# Altium project Medusa-AI-coral-dev.PrjPcb
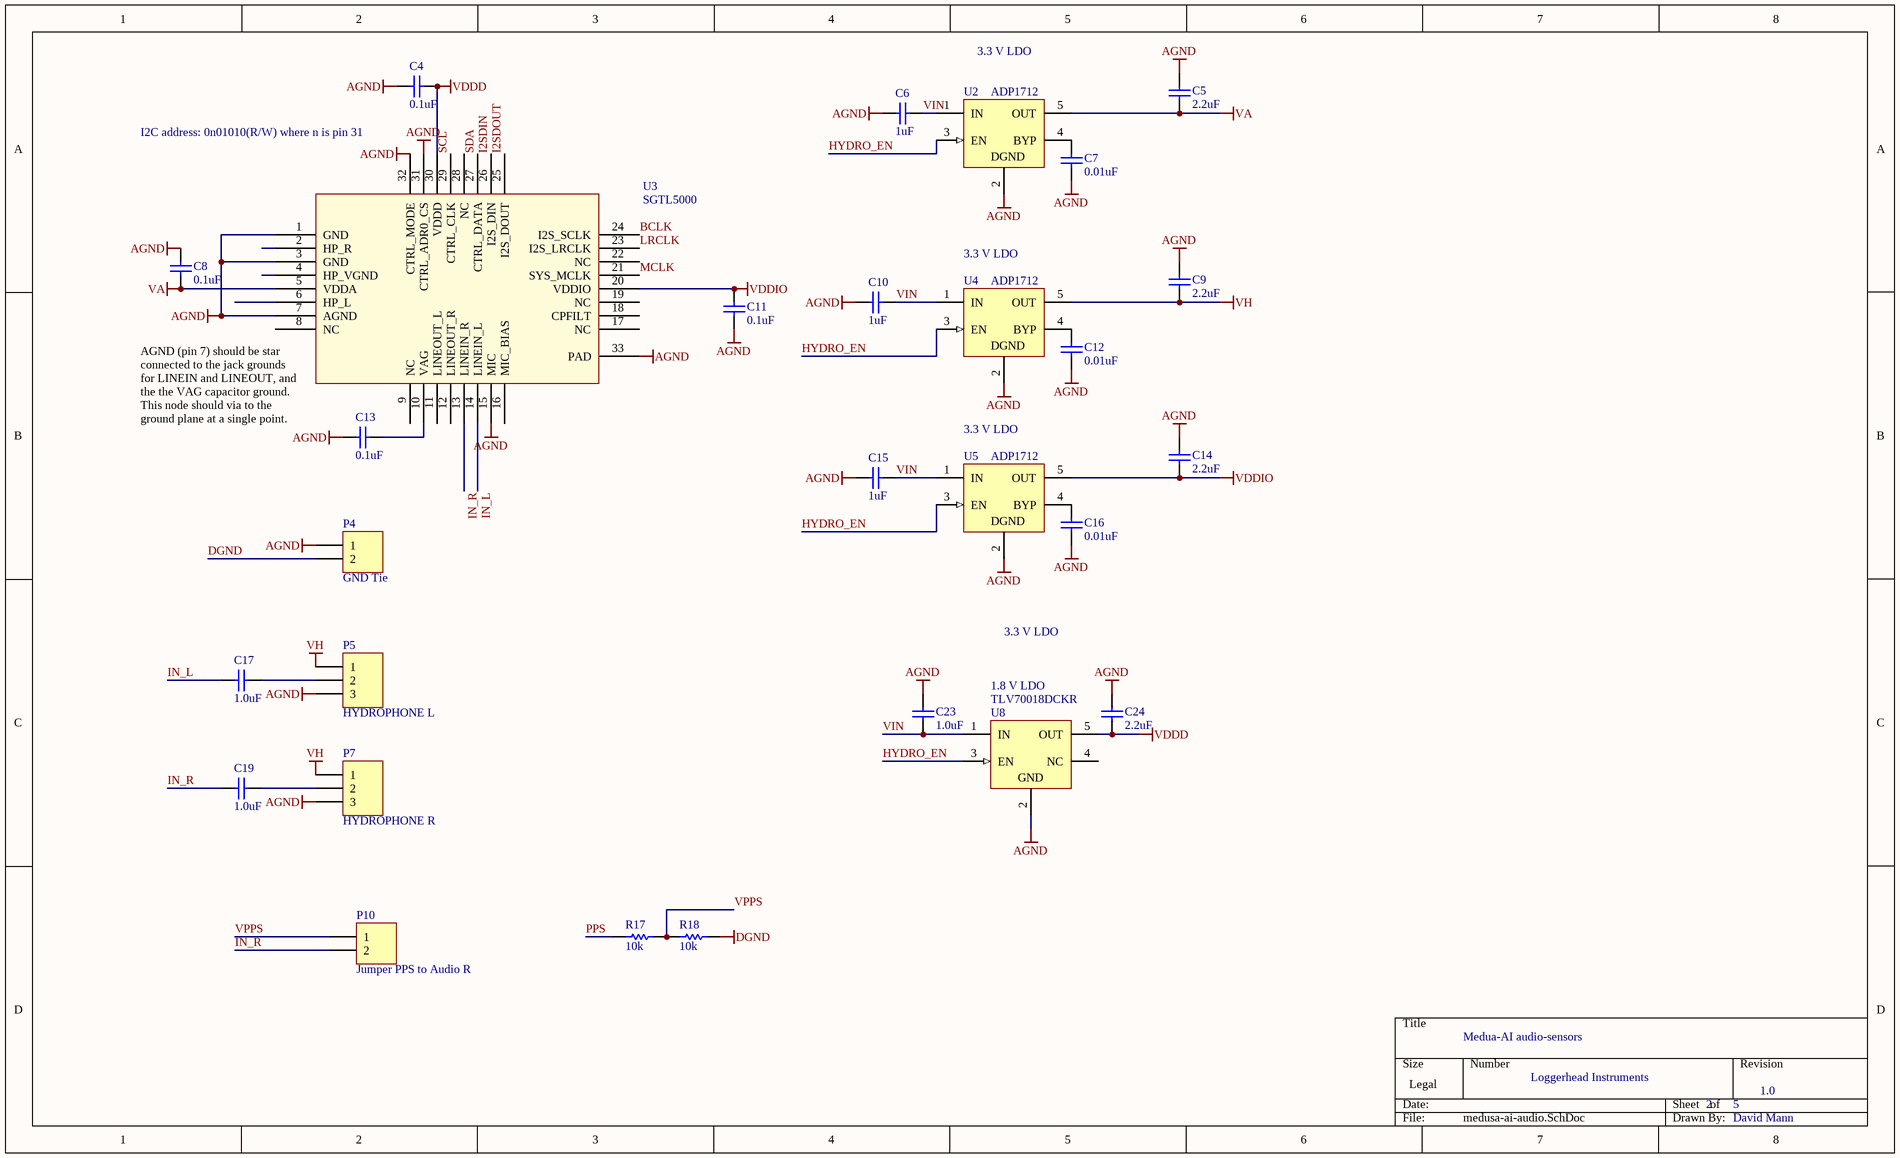
[diagram p0: medusa-ai-audio.SchDoc]
5 sheets, 118 parts. Net scope: global (net labels, ports and power ports of the same name join across sheets).
Board file: Medusa-AI-coral-dev.PcbDoc
Sheets:
  medusa-ai-audio.SchDoc
  medusa-ai-power.SchDoc
  medusa-charger.SchDoc
  medusa-ai-sensors.SchDoc
  Medusa-AI-coral-dev.SchDoc

## Sheet medusa-ai-audio.SchDoc
size Legal; SheetNumber: 1; SheetTotal: 5

### Parts
C4  0.1uF  [0402]
C5  2.2uF  [0402]
C6  1uF  [0402]
C7  0.01uF  [0402]
C8  0.1uF  [0402]
C9  2.2uF  [0402]
C10  1uF  [0402]
C11  0.1uF  [0402]
C12  0.01uF  [0402]
C13  0.1uF  [0402]
C14  2.2uF  [0402]
C15  1uF  [0402]
C16  0.01uF  [0402]
C17  1.0uF  [0402]
C19  1.0uF  [0402]
C23  1.0uF  [0402]
C24  2.2uF  [0402]
P4  GND Tie  [HDR1X2]
P5  HYDROPHONE L  [HDR1X3]
P7  HYDROPHONE R  [HDR1X3]
P10  Jumper PPS to Audio R  [HDR1X2]
R17  10k  [3-0603]
R18  10k  [3-0603]
U2  ADP1712  [MF05A_N]
U3  SGTL5000  [QFN32]
U4  ADP1712  [MF05A_N]
U5  ADP1712  [MF05A_N]
U8  TLV70018DCKR  [TI-DCK5_V]

### Nets
AGND: C4.2 C5.2 C6.2 C7.2 C8.2 C9.2 C10.2 C11.2 C12.2 C13.2 C14.2 C15.2 C16.2 C23.2 C24.2 P4.1 P5.3 P7.3 U2.2(GND) U3.1(GND) U3.3(GND) U3.7(AGND) U3.15(MIC) U3.31(CTRL_ADR0_CS) U3.32(CTRL_MODE) U3.33(PAD) U4.2(GND) U5.2(GND) U8.2(GND)
DGND: P4.2 R18.1
VA: C5.1 C8.1 U2.5(OUT) U3.5(VDDA)
VDDD: C4.1 C24.1 U3.30(VDDD) U8.5(OUT)
VDDIO: C11.1 C14.1 U3.20(VDDIO) U5.5(OUT)
VH: C9.1 P5.1 P7.1 U4.5(OUT)
VIN: C6.1 C10.1 C15.1 C23.1 U2.1(IN) U4.1(IN) U5.1(IN) U8.1(IN)
BCLK: U3.24(I2S_SCLK)
HYDRO_EN: U2.3(EN) U4.3(EN) U5.3(EN) U8.3(EN)
I2SDIN: U3.26(I2S_DIN)
I2SDOUT: U3.25(I2S_DOUT)
IN_L: C17.2 U3.14(LINEIN_L)
IN_R: C19.2 P10.2 U3.13(LINEIN_R)
LRCLK: U3.23(I2S_LRCLK)
MCLK: U3.21(SYS_MCLK)
PPS: R17.2
SCL: U3.29(CTRL_CLK)
SDA: U3.27(CTRL_DATA)
VPPS: P10.1 R17.1 R18.2
NetC7_1: C7.1 U2.4(BYP)
NetC12_1: C12.1 U4.4(BYP)
NetC13_1: C13.1 U3.10(VAG)
NetC16_1: C16.1 U5.4(BYP)
NetC17_1: C17.1 P5.2
NetC19_1: C19.1 P7.2

Not connected (* = marked no-connect by the designer): U3 2(HP_R) 4(HP_VGND) 6(HP_L) 8(NC) 9(NC) 11(LINEOUT_L) 12(LINEOUT_R) 16(MIC_BIAS) 17(NC) 18(CPFILT) 19(NC) 22(NC) 28(NC); U8 4(NC)

### Notes on the sheet
- 3.3 V LDO
- I2C address: 0n01010(R/W) where n is pin 31
- (near U4) 3.3 V LDO
- (near U3) AGND (pin 7) should be star connected to the jack grounds for LINEIN and LINEOUT, and the the VAG capacitor ground. This node should via to the ground plane at a single point.
- (near U5) 3.3 V LDO
- (near U8) 1.8 V LDO
- Medua-AI audio-sensors
- Loggerhead Instruments
- 2
- 5
- 1.0
- David Mann
- (in symbol LP3985IM5-3.3) DGND

### Library data of the parts
C4 C8 C11 C13 = C0402: Ceramic Chip Capacitor - Standard; Note: Footprint corresponds to dimensions for bulk cassette packaging. This case size has tightened tolerances.; Published: 17-Jul-2002; LatestRevisionDate: 19-Mar-2004; LatestRevisionNote: Silkscreen size reduced.; DatasheetDocument: Mar-2001; PackageDocument: Mar-2001; PackageReference: 0402; Publisher: Altium Limited; Code_JEITA: 0402; Code_IPC: 1005 [0402]; ComponentLink1Description: Manufacturer Link; ComponentLink1URL: http://www.kemet.com/; ComponentLink2Description: Datasheet; ComponentLink2URL: http://www.kemet.com/kemet/web/homepage/kechome.nsf/vapubfilesname/F3102TA.pdf/$file/F3102TA.pdf; Value: 0.1uF
C5-C7 C9 C10 C12 C14-C17 C19 C23 C24 = C0402: Ceramic Chip Capacitor - Standard; Note: Footprint corresponds to dimensions for bulk cassette packaging. This case size has tightened tolerances.; Value: 0.1uF; Published: 17-Jul-2002; LatestRevisionDate: 19-Mar-2004; LatestRevisionNote: Silkscreen size reduced.; DatasheetDocument: Mar-2001; PackageDocument: Mar-2001; PackageReference: 0402; Publisher: Altium Limited; Code_JEITA: 0402; Code_IPC: 1005 [0402]; ComponentLink1Description: Manufacturer Link; ComponentLink1URL: http://www.kemet.com/; ComponentLink2Description: Datasheet; ComponentLink2URL: http://www.kemet.com/kemet/web/homepage/kechome.nsf/vapubfilesname/F3102TA.pdf/$file/F3102TA.pdf
P4 P10 = Header 2: Header, 2-Pin; LatestRevisionDate: 17-Jul-2002; LatestRevisionNote: Re-released for DXP Platform.; Publisher: Altium Limited
P5 P7 = Header 3: Header, 3-Pin; LatestRevisionDate: 17-Jul-2002; LatestRevisionNote: Re-released for DXP Platform.; Publisher: Altium Limited
R17 R18 = ERJ3RK: Precision Thick Film Chip Resistor, 10 Ohm to 1M Ohm Range, 1% and 0.5% Tolerance, 0603 Size, 0.063 W; Published: 17-Dec-2003; LatestRevisionDate: 19-Mar-2004; LatestRevisionNote: Silkscreen size reduced.; PackageDocument: Mar-2003; PackageReference: 3-0603; Publisher: Altium Limited; Code_IPC: 1608 [0603]; ComponentLink1Description: Manufacturer Link; ComponentLink1URL: http://www.panasonic.com/industrial/components/resistive_products.htm; ComponentLink2Description: Datasheet; ComponentLink2URL: http://www.panasonic.com/industrial/components/pdf/AOA0000CE2.pdf
U2 U4 U5 = LP3985IM5-3.3: Micropower, 150mA Low-Noise Ultra Low-Dropout CMOS Voltage Regulator; Manufacturer: National Semiconductor; CompType: LDO IC; PackageTopMarking: LDQB*XTT; PowerWise: N; Published: 4-Dec-2008; DatasheetVersion: Aug-2005; PackageVersion: revD, Aug-2008; PackageReference: MF05A; Publisher: Altium Limited; PackageDescription: Molded SOT-23, .115 x .063 x .040 in Body, 5 Lead, .0375 in Pitch; PartNumber: LP3985IM5-3.3; RoHS: O; PinCount: 5; DigiKeyPartNumber: LP3985IM5-3.3CT-ND; ComponentLink1Description: LP3985 Datasheet; ComponentLink1URL: http://www.national.com/ds/LP/LP3985.pdf; ComponentLink2Description: LP3985 Web Page; ComponentLink2URL: http://www.national.com/pf/LP/LP3985.html; ComponentLink3Description: MF05A Package Page; ComponentLink3URL: http://www.national.com/packaging/folders/mf05a.html
U8 = TLV70018DCKR: Single Output LDO, 200 mA, Fixed 1.8 V Output, 2 to 5.5 V Input, with Low IQ, 5-pin SC70 (DCK), -40 to 125 degC, Green (RoHS & no Sb/Br); Manufacturer: Texas Instruments; Accuracy(%): 2; Fixed Output Options(V): 1.8; Iout(Max)(A): 0.2; Iq(Typ)(mA): 0.03; SubFamily: Single Channel LDO; Vdo(Typ)(mV): 175; Vin(Max)(V): 5.5; DatasheetVersion: SLVSA00D; PackageVersion: 4093553-3/G; PackageReference: DCK5; PackageDescription: 5-Pin Plastic Small-Outline, Body 2 x 1.25 mm, Pitch 0.65 mm; Supplier 1: Digi-Key; Supplier Part Number 1: 296-32409-2-ND; Supplier 2: Digi-Key; Supplier Part Number 2: 296-32409-1-ND; Supplier 3: Digi-Key; Supplier Part Number 3: 296-32409-6-ND; Supplier 4: Newark; Supplier Part Number 4: 55R7461; Supplier 5: Mouser; Supplier Part Number 5: 595-TLV70018DCKR; Eco-Plan: Green (RoHS & no Sb/Br); Vin(Min)(V): 2; Vout Adj(Max)(V): 1.8; Vout Adj(Min)(V): 1.8; Mounting Technology: Surface Mount; Code_JEDEC: MO-203; PartNumber: TLV70018DCKR; ComponentLink1Description: Manufacturer URL; ComponentLink1URL: http://www.ti.com/; ComponentLink2Description: Datasheet; ComponentLink2URL: http://www.ti.com/general/docs/lit/getliterature.tsp?genericPartNumber=TLV70018&fileType=pdf; ComponentLink3Description: Package Specification; ComponentLink3URL: http://www.ti.com/litv/pdf/mpds025f

## Sheet medusa-ai-power.SchDoc
size Legal; SheetNumber: 3; SheetTotal: 5
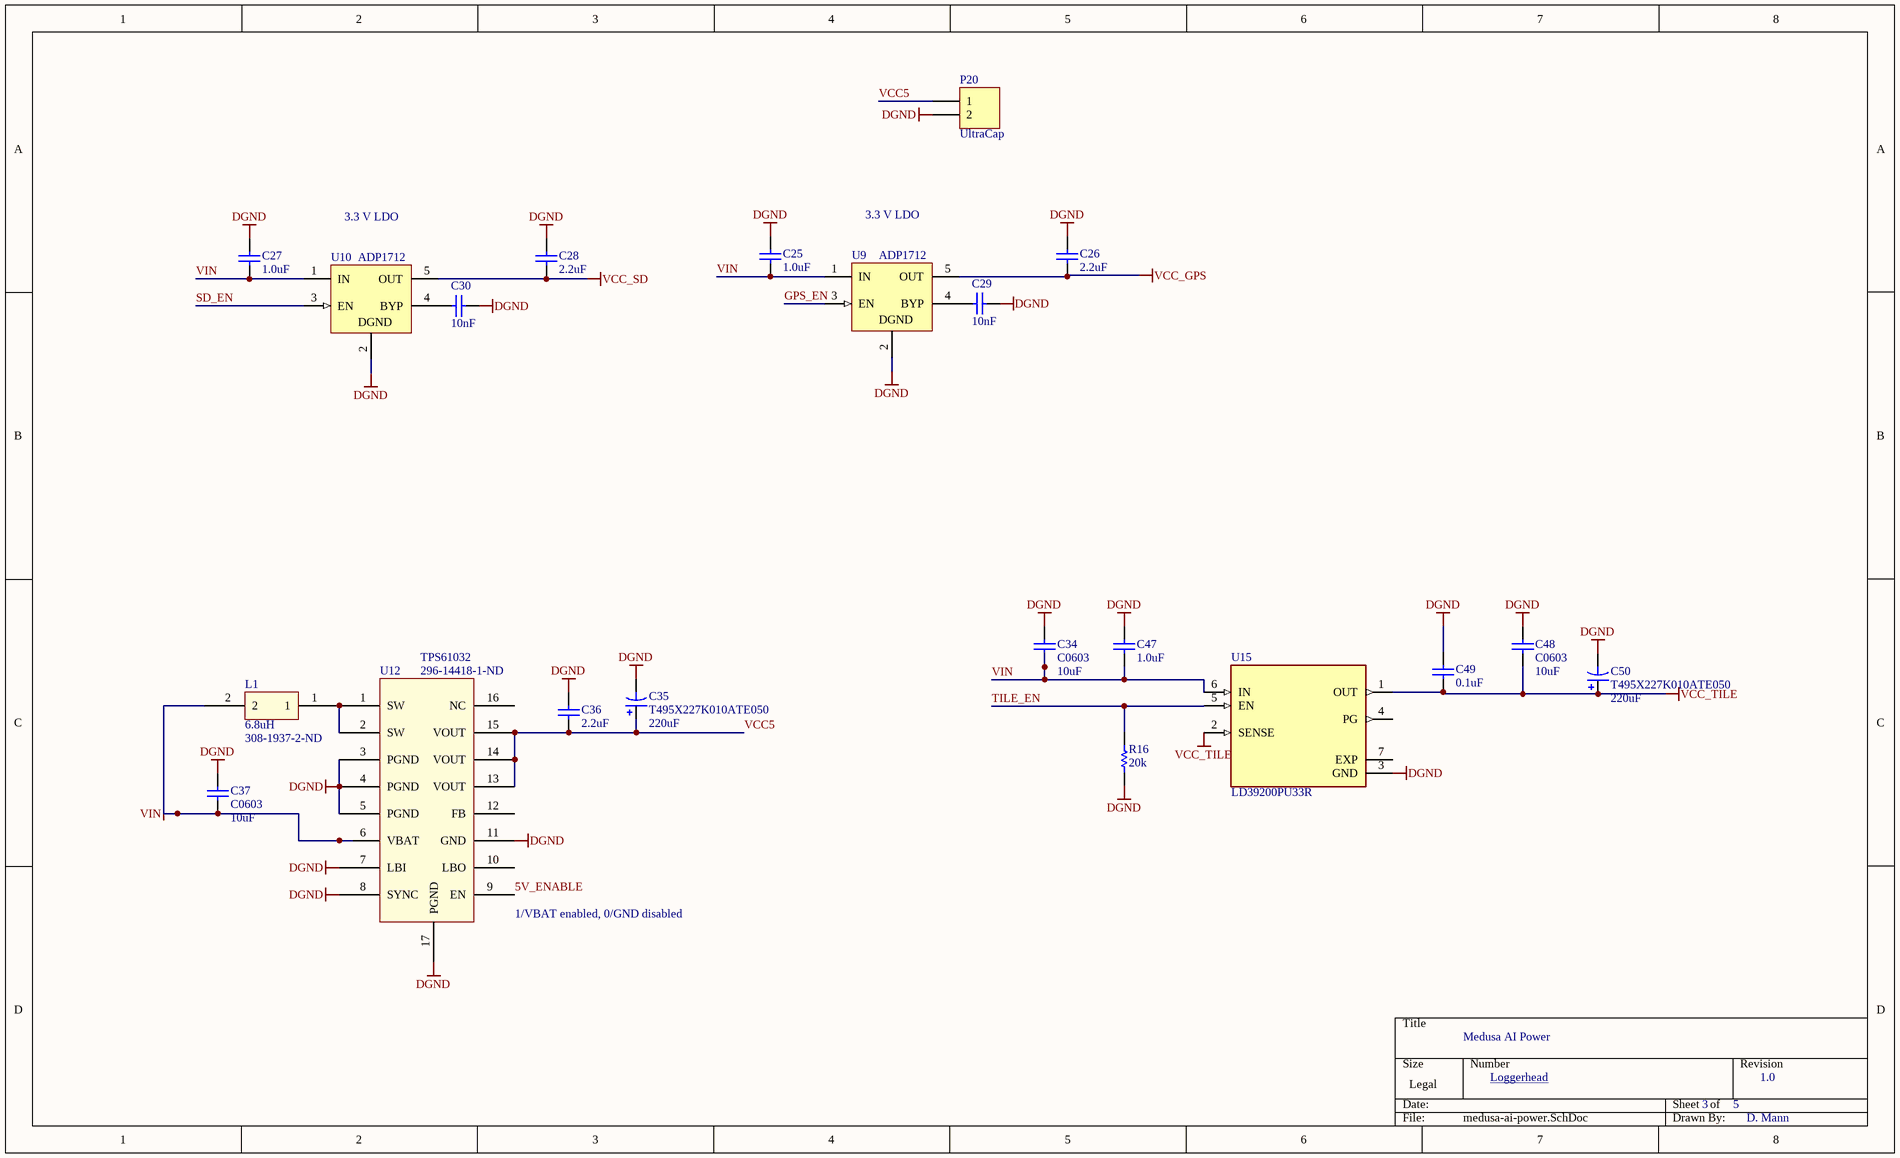
[diagram p1: medusa-ai-power.SchDoc]

### Parts
C25  1.0uF  [0402]
C26  2.2uF  [0402]
C27  1.0uF  [0402]
C28  2.2uF  [0402]
C29  10nF  [0402]
C30  10nF  [0402]
C34  C0603  value 10uF  [0603]
C35  T495X227K010ATE050  value 220uF  [X]
C36  2.2uF  [0402]
C37  C0603  value 10uF  [0603]
C47  1.0uF  [0402]
C48  C0603  value 10uF  [0603]
C49  0.1uF  [0402]
C50  T495X227K010ATE050  value 220uF  [X]
L1  6.8uH  Supplier Part Number 1: 308-1937-2-ND  [Inductor - duplicate]
P20  UltraCap  [HDR1X2]
R16  20k  [3-0603]
U9  ADP1712  [MF05A_N]
U10  ADP1712  [MF05A_N]
U12  TPS61032  Supplier Part Number 2: 296-14418-1-ND  [TPS6103x]
U15  LD39200PU33R  [SON95P300X300X100-7N]

### Nets
DGND: C25.2 C26.2 C27.2 C28.2 C29.1 C30.1 C34.1 C35.2 C36.2 C37.1 C47.2 C48.1 C49.2 C50.2 P20.2 R16.2 U9.2(GND) U10.2(GND) U12.3(PGND) U12.4(PGND) U12.5(PGND) U12.7(LBI) U12.8(SYNC) U12.11(GND) U12.17(PGND) U15.3(GND)
VCC_GPS: C26.1 U9.5(OUT)
VCC_SD: C28.1 U10.5(OUT)
VCC_TILE: C48.2 C49.1 C50.1 U15.1(OUT) U15.2(SENSE)
VIN: C25.1 C27.1 C34.2 C37.2 C47.1 L1.2 U9.1(IN) U10.1(IN) U12.6(VBAT) U15.6(IN)
5V_ENABLE: U12.9(EN)
GPS_EN: U9.3(EN)
SD_EN: U10.3(EN)
TILE_EN: R16.1 U15.5(EN)  [project net IR_SLEEP]
VCC5: C35.1 C36.1 P20.1 U12.13(VOUT) U12.14(VOUT) U12.15(VOUT)
NetC29_2: C29.2 U9.4(BYP)
NetC30_2: C30.2 U10.4(BYP)
NetL1_1: L1.1 U12.1(SW) U12.2(SW)

Not connected (* = marked no-connect by the designer): U12 10(LBO) 12(FB) 16(NC); U15 4(PG) 7(EXP)

### Notes on the sheet
- 3.3 V LDO
- (near U12) 1/VBAT enabled, 0/GND disabled
- Medusa AI Power
- Loggerhead
- 3
- 5
- 1.0
- D. Mann
- (in symbol LP3985IM5-3.3) DGND

### Library data of the parts
C25-C30 C47 = C0402: as C5 on sheet medusa-ai-audio; Published: 17-Jul-2002; LatestRevisionDate: 19-Mar-2004; LatestRevisionNote: Silkscreen size reduced.; DatasheetDocument: Mar-2001; PackageDocument: Mar-2001; PackageReference: 0402; Publisher: Altium Limited; Code_JEITA: 0402; Code_IPC: 1005 [0402]; ComponentLink1Description: Manufacturer Link; ComponentLink1URL: http://www.kemet.com/; ComponentLink2Description: Datasheet; ComponentLink2URL: http://www.kemet.com/kemet/web/homepage/kechome.nsf/vapubfilesname/F3102TA.pdf/$file/F3102TA.pdf
C34 C37 C48 = C0603: Ceramic Chip Capacitor - Standard; Note: Footprint corresponds to dimensions for bulk cassette packaging. This case size has tightened tolerances.; Published: 17-Jul-2002; LatestRevisionDate: 19-Mar-2004; LatestRevisionNote: Silkscreen size reduced.; DatasheetDocument: Mar-2001; PackageDocument: Mar-2001; PackageReference: 0603; Publisher: Altium Limited; Code_JEITA: 0603; Code_IPC: 1608 [0603]; ComponentLink1Description: Manufacturer Link; ComponentLink1URL: http://www.kemet.com/; ComponentLink2Description: Datasheet; ComponentLink2URL: http://www.kemet.com/kemet/web/homepage/kechome.nsf/vapubfilesname/F3102TA.pdf/$file/F3102TA.pdf
C35 C50 = T495X: Solid Tantalum Chip Capacitor, Standard T495 Series - Low ESR, Surge Robust; PCB_Layout: Round Glue Pad at 2.9 ±0.1mm in diameter at KEMET's option; Published: 17-Jul-2002; LatestRevisionDate: 19-Mar-2004; LatestRevisionNote: Silkscreen dimensions re-sized.; DatasheetDocument: Mar-2001; PackageDocument: Mar-2001; PackageReference: X; Publisher: Altium Limited; Code_JEITA: 7343-43; ComponentLink1Description: Manufacturer Link; ComponentLink1URL: http://www.kemet.com/; ComponentLink2Description: Datasheet; ComponentLink2URL: http://www.kemet.com/kemet/web/homepage/kechome.nsf/vapubfilesname/F3102TA.pdf/$file/F3102TA.pdf
C36 C49 = C0402: as C4 on sheet medusa-ai-audio; Published: 17-Jul-2002; LatestRevisionDate: 19-Mar-2004; LatestRevisionNote: Silkscreen size reduced.; DatasheetDocument: Mar-2001; PackageDocument: Mar-2001; PackageReference: 0402; Publisher: Altium Limited; Code_JEITA: 0402; Code_IPC: 1005 [0402]; ComponentLink1Description: Manufacturer Link; ComponentLink1URL: http://www.kemet.com/; ComponentLink2Description: Datasheet; ComponentLink2URL: http://www.kemet.com/kemet/web/homepage/kechome.nsf/vapubfilesname/F3102TA.pdf/$file/F3102TA.pdf
  C36: Value: 2.2uF
  C49: Value: 0.1uF
L1 = Inductor 6.8uH: Sumida Inductor; Supplier 1: Digi-Key
P20 = Header 2: Header, 2-Pin; LatestRevisionDate: 17-Jul-2002; LatestRevisionNote: Re-released for DXP Platform.; Publisher: Altium Limited
R16 = ERJ3RK: as R17 on sheet medusa-ai-audio; Published: 17-Dec-2003; LatestRevisionDate: 19-Mar-2004; LatestRevisionNote: Silkscreen size reduced.; PackageDocument: Mar-2003; PackageReference: 3-0603; Publisher: Altium Limited; Code_IPC: 1608 [0603]; ComponentLink1Description: Manufacturer Link; ComponentLink1URL: http://www.panasonic.com/industrial/components/resistive_products.htm; ComponentLink2Description: Datasheet; ComponentLink2URL: http://www.panasonic.com/industrial/components/pdf/AOA0000CE2.pdf
U9 U10 = LP3985IM5-3.3: as U2 on sheet medusa-ai-audio; Published: 4-Dec-2008; DatasheetVersion: Aug-2005; PackageVersion: revD, Aug-2008; PackageReference: MF05A; Publisher: Altium Limited; PackageDescription: Molded SOT-23, .115 x .063 x .040 in Body, 5 Lead, .0375 in Pitch; PartNumber: LP3985IM5-3.3; RoHS: O; PinCount: 5; DigiKeyPartNumber: LP3985IM5-3.3CT-ND; ComponentLink1Description: LP3985 Datasheet; ComponentLink1URL: http://www.national.com/ds/LP/LP3985.pdf; ComponentLink2Description: LP3985 Web Page; ComponentLink2URL: http://www.national.com/pf/LP/LP3985.html; ComponentLink3Description: MF05A Package Page; ComponentLink3URL: http://www.national.com/packaging/folders/mf05a.html
U12 = TPS6103x: Boost converter; Supplier 1: Newark; Supplier 2: Digi-Key
U15 = LD39200PU33R: Linear Voltage Regulator IC 1 Output 2A 6-DFN _3x3_; MF: STMicroelectronics; Package: DFN-6 STMicroelectronics; SnapEDA_Link: https://www.snapeda.com/parts/LD39200PU33R/STMicroelectronics/view-part/482679/?ref=snap; MP: LD39200PU33R; Value: *; Availability: Unavailable; Price: None

## Sheet medusa-charger.SchDoc
size Legal; SheetNumber: 3; SheetTotal: 5
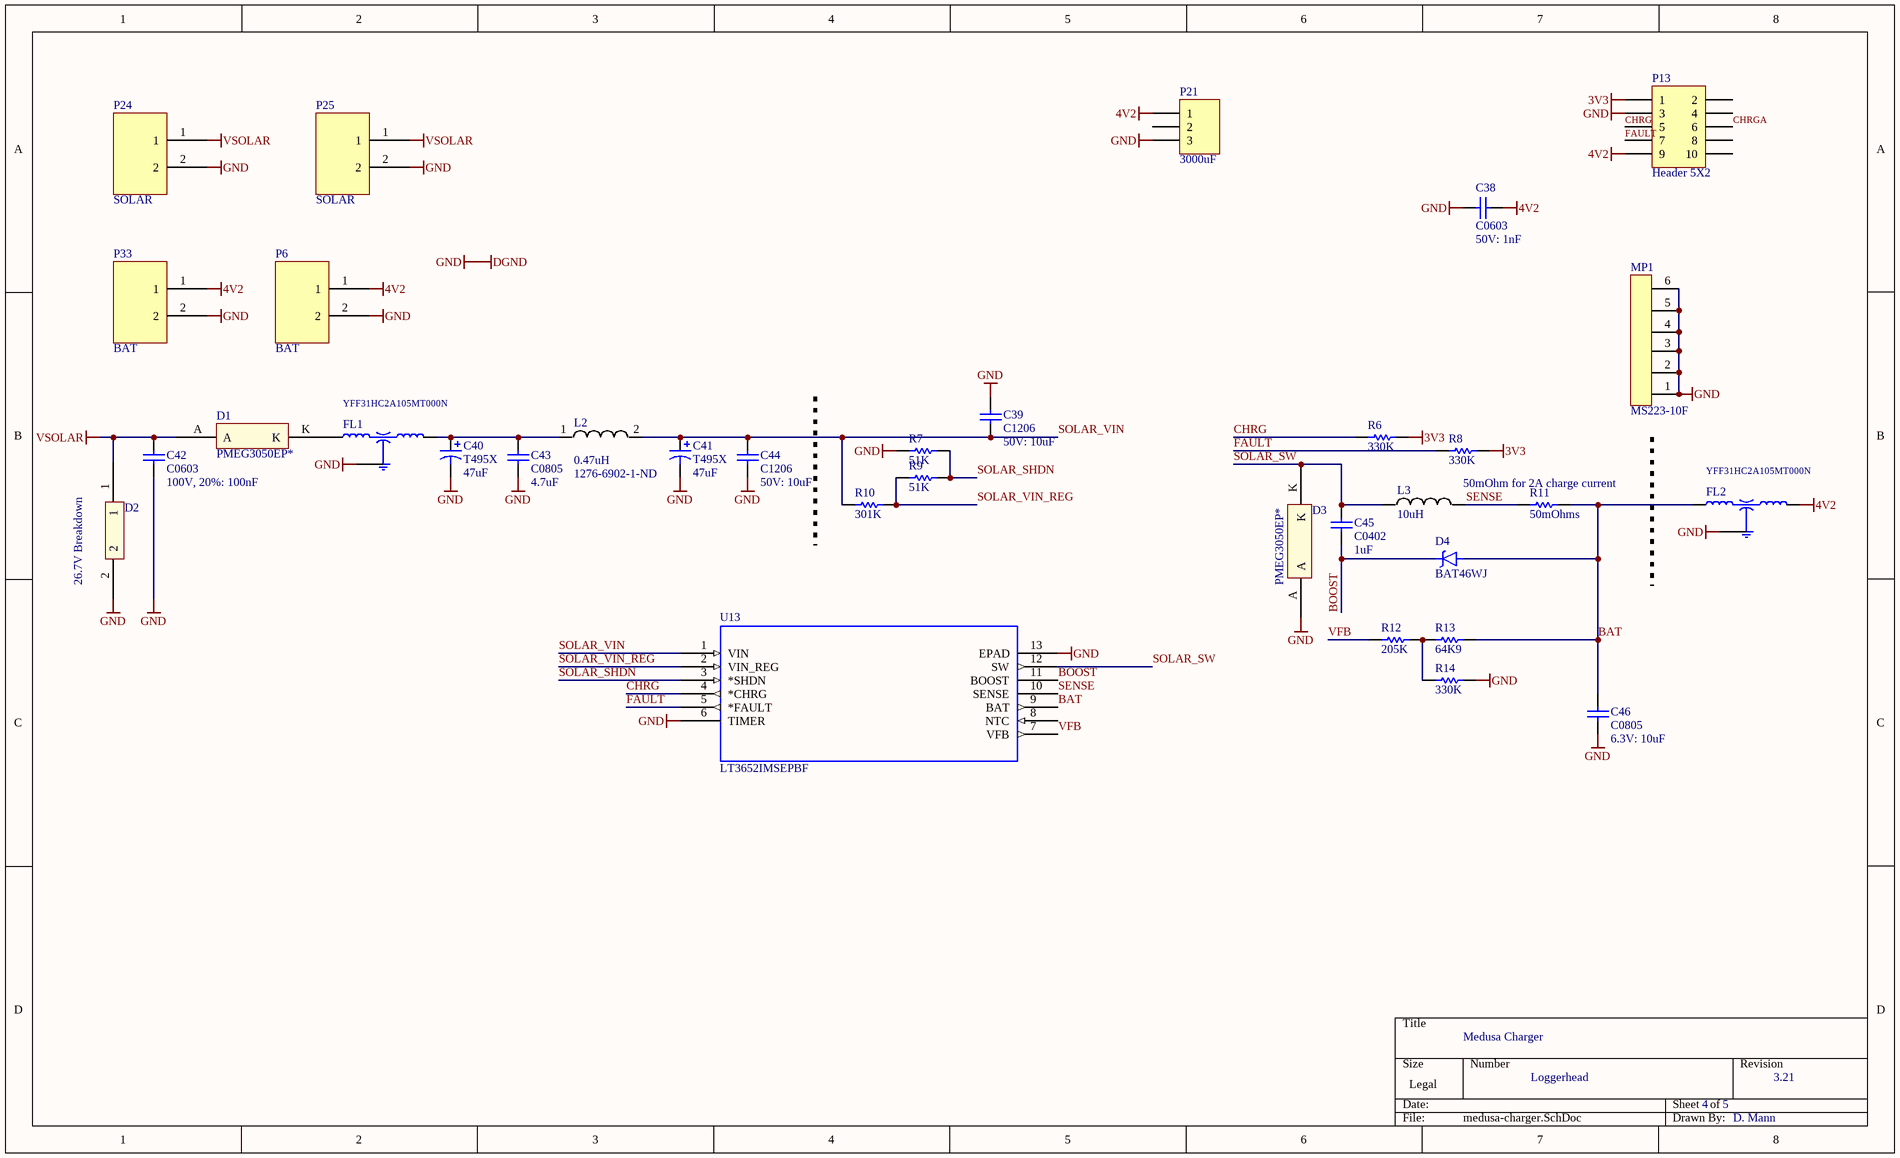
[diagram p2: medusa-charger.SchDoc]

### Parts
C38  C0603  50V: 1nF  [0603]
C39  C1206  50V: 10uF  [1206]
C40  T495X  value 47uF  [X]
C41  T495X  value 47uF  [X]
C42  C0603  100V, 20%: 100nF  [0603]
C43  C0805  value 4.7uF  [0805]
C44  C1206  50V: 10uF  [1206]
C45  C0402  value 1uF  [0402]
C46  C0805  6.3V: 10uF  [0805]
D1  PMEG3050EP*  [Diode_PMEG3050EP]
D2  26.7V Breakdown  [SMBJ24CA]
D3  PMEG3050EP*  [Diode_PMEG3050EP]
D4  BAT46WJ  [SOD-323]
FL1  YFF31HC2A105MT000N  [FIL_YFF31HC2A105MT000N]
FL2  YFF31HC2A105MT000N  [FIL_YFF31HC2A105MT000N]
L2  value 0.47uH  Supplier Part Number 1: 1276-6902-1-ND  [Inductor2016]  (hidden comment: Inductor2016)
L3  10uH  [Inductor0630CDMCD]
MP1  MS223-10F  [MS223-10F]
P6  BAT  [HDR_2x1_2mm]
P13  Header 5X2  [HDR2X5]
P21  3000uF  [HDR1X3]
P24  SOLAR  [HDR_2x1_2mm]
P25  SOLAR  [HDR_2x1_2mm]
P33  BAT  [HDR_2x1_2mm]
R6  330K  [3-0603]
R7  51K  [3-0603]
R8  330K  [3-0603]
R9  51K  [3-0603]
R10  301K  [3-0603]
R11  50mOhms  [8-1206]
R12  205K  [3-0603]
R13  64K9  [3-0603]
R14  330K  [3-0603]
U13  LT3652IMSEPBF  [MSOP-12_MSE]

### Nets
3V3: P13.1 R6.1 R8.1
4V2: C38.2 FL2.3(OUT/IN) P6.1 P13.9 P21.1 P33.1
DGND: C38.1 C39.1 C40.2 C41.2 C42.1 C43.1 C44.1 C46.1 D2.2 D3.A FL1.2_4(GND) FL2.2_4(GND) MP1.1 MP1.2 MP1.3 MP1.4 MP1.5 MP1.6 P6.2 P13.3 P21.3 P24.2 P25.2 P33.2 R7.1 R14.1 U13.6(TIMER) U13.13(EPAD)  [also labelled GND]
VSOLAR: C42.2 D1.A D2.1 P24.1 P25.1
BAT: C46.2 D4.A FL2.1(IN/OUT) R11.2 R13.1 U13.9(BAT)
BOOST: C45.1 D4.C U13.11(BOOST)
CHRG: P13.5 R6.2 U13.4(*CHRG)
CHRGA: P13.6
FAULT: P13.7 R8.2 U13.5(*FAULT)
SENSE: L3.2 R11.1 U13.10(SENSE)
SOLAR_SHDN: R7.2 R9.2 U13.3(*SHDN)
SOLAR_SW: C45.2 D3.K L3.1 U13.12(SW)
SOLAR_VIN: C39.2 C41.1 C44.2 L2.2 R10.1 U13.1(VIN)
SOLAR_VIN_REG: R9.1 R10.2 U13.2(VIN_REG)
VFB: R12.2 U13.7(VFB)
NetC40_1: C40.1 C43.2 FL1.3(OUT/IN) L2.1
NetD1_K: D1.K FL1.1(IN/OUT)
NetR12_1: R12.1 R13.2 R14.2

Not connected (* = marked no-connect by the designer): P13 2 4 8 10; P21 2; U13 8(NTC)

### Notes on the sheet
- 50mOhm for 2A charge current
- Medusa Charger
- Loggerhead
- 4
- 5
- 3.21
- D. Mann

### Library data of the parts
C38 = C0603: as C34 on sheet medusa-ai-power; Published: 17-Jul-2002; LatestRevisionDate: 19-Mar-2004; LatestRevisionNote: Silkscreen size reduced.; DatasheetDocument: Mar-2001; PackageDocument: Mar-2001; PackageReference: 0603; Publisher: Altium Limited; Code_JEITA: 0603; Code_IPC: 1608 [0603]; ComponentLink1Description: Manufacturer Link; ComponentLink1URL: http://www.kemet.com/; ComponentLink2Description: Datasheet; ComponentLink2URL: http://www.kemet.com/kemet/web/homepage/kechome.nsf/vapubfilesname/F3102TA.pdf/$file/F3102TA.pdf
C39 C44 = C1206: Ceramic Chip Capacitor - Standard; Published: 17-Jul-2002; LatestRevisionDate: 19-Mar-2004; LatestRevisionNote: Silkscreen size reduced.; DatasheetDocument: Mar-2001; PackageDocument: Mar-2001; PackageReference: 1206; Publisher: Altium Limited; Code_JEITA: 1206; Code_IPC: 3216 [1206]; ComponentLink1Description: Manufacturer Link; ComponentLink1URL: http://www.kemet.com/; ComponentLink2Description: Datasheet; ComponentLink2URL: http://www.kemet.com/kemet/web/homepage/kechome.nsf/vapubfilesname/F3102TA.pdf/$file/F3102TA.pdf
C40 C41 = T495X: Solid Tantalum Chip Capacitor, Standard T495 Series - 35V 10%; PCB_Layout: Round Glue Pad at 2.9 ±0.1mm in diameter at KEMET's option; Published: 17-Jul-2002; LatestRevisionDate: 19-Mar-2004; LatestRevisionNote: Silkscreen dimensions re-sized.; DatasheetDocument: Mar-2001; PackageDocument: Mar-2001; PackageReference: X; Publisher: Altium Limited; Code_JEITA: 7343-43; ComponentLink1Description: Manufacturer Link; ComponentLink1URL: http://www.kemet.com/; ComponentLink2Description: Datasheet; ComponentLink2URL: http://www.kemet.com/kemet/web/homepage/kechome.nsf/vapubfilesname/F3102TA.pdf/$file/F3102TA.pdf
C42 = C0603: 100V 20%; Note: Footprint corresponds to dimensions for bulk cassette packaging. This case size has tightened tolerances.; Published: 17-Jul-2002; LatestRevisionDate: 19-Mar-2004; LatestRevisionNote: Silkscreen size reduced.; DatasheetDocument: Mar-2001; PackageDocument: Mar-2001; PackageReference: 0603; Publisher: Altium Limited; Code_JEITA: 0603; Code_IPC: 1608 [0603]; ComponentLink1Description: Manufacturer Link; ComponentLink1URL: http://www.kemet.com/; ComponentLink2Description: Datasheet; ComponentLink2URL: http://www.kemet.com/kemet/web/homepage/kechome.nsf/vapubfilesname/F3102TA.pdf/$file/F3102TA.pdf
C43 C46 = C0805: Ceramic Chip Capacitor - Standard; Note: Footprint corresponds to dimensions for bulk cassette packaging. This case size has tightened tolerances.; Published: 17-Jul-2002; LatestRevisionDate: 19-Mar-2004; LatestRevisionNote: Silkscreen size reduced.; DatasheetDocument: Mar-2001; PackageDocument: Mar-2001; PackageReference: 0805; Publisher: Altium Limited; Code_JEITA: 0805; Code_IPC: 2012[0805]; ComponentLink1Description: Manufacturer Link; ComponentLink1URL: http://www.kemet.com/; ComponentLink2Description: Datasheet; ComponentLink2URL: http://www.kemet.com/kemet/web/homepage/kechome.nsf/vapubfilesname/F3102TA.pdf/$file/F3102TA.pdf
C45 = C0402: as C4 on sheet medusa-ai-audio; Published: 17-Jul-2002; LatestRevisionDate: 19-Mar-2004; LatestRevisionNote: Silkscreen size reduced.; DatasheetDocument: Mar-2001; PackageDocument: Mar-2001; PackageReference: 0402; Publisher: Altium Limited; Code_JEITA: 0402; Code_IPC: 1005 [0402]; ComponentLink1Description: Manufacturer Link; ComponentLink1URL: http://www.kemet.com/; ComponentLink2Description: Datasheet; ComponentLink2URL: http://www.kemet.com/kemet/web/homepage/kechome.nsf/vapubfilesname/F3102TA.pdf/$file/F3102TA.pdf
D1 D3 = Diode_PMEG3050EP
D2 = SMBJ24CA
D4 = BAT46WJ: Diode Schottky 100V 250mA (DC) Surface Mount SOD-323F; MF: NXP Semiconductors; SnapEDA_Link: https://www.snapeda.com/parts/BAT46WJ/NXP%20Semiconductors/view-part/4222338/?ref=snap; Package: SOD-323 NXP Semiconductors; Availability: Bad; Price: None; MP: BAT46WJ; Value: *
FL1 FL2 = YFF31HC2A105MT000N: 1ÂµF Feed Through Capacitor 100V 6A 5mOhm 1206 (3216 Metric), 4 PC Pad; MF: TDK; Value: *; Availability: Good; Price: None; SnapEDA_Link: https://www.snapeda.com/parts/YFF31HC2A105MT000N/TDK-Lambda%20Americas%20Inc/view-part/566443/?ref=snap; Check_prices: https://www.snapeda.com/parts/YFF31HC2A105MT000N/TDK-Lambda%20Americas%20Inc/view-part/566443/?ref=eda; Purchase-URL: https://pricing.snapeda.com/search/part/YFF31HC2A105MT000N/?ref=eda; Package: 1206 TDK; MP: YFF31HC2A105MT000N
L3 = Inductor_0630CDMCD
MP1 = MS223-10F: RF Shield
P6 P24 P25 P33 = HDR_2x1_2mm
P13 = Header 5X2: Header, 5-Pin, Dual row; LatestRevisionDate: 17-Jul-2002; LatestRevisionNote: Re-released for DXP Platform.; Publisher: Altium Limited
P21 = Header 3: Header, 3-Pin; LatestRevisionDate: 17-Jul-2002; LatestRevisionNote: Re-released for DXP Platform.; Publisher: Altium Limited
R6-R10 R12-R14 = ERJ3EK: Precision Thick Film Chip Resistor, 10 Ohm to 1M Ohm Range, 1% and 0.5% Tolerance, 0603 Size, 0.063 W; Published: 17-Dec-2003; LatestRevisionDate: 19-Mar-2004; LatestRevisionNote: Silkscreen size reduced.; PackageDocument: Mar-2003; PackageReference: 3-0603; Publisher: Altium Limited; Code_IPC: 1608 [0603]; ComponentLink1Description: Manufacturer Link; ComponentLink1URL: http://www.panasonic.com/industrial/components/resistive_products.htm; ComponentLink2Description: Datasheet; ComponentLink2URL: http://www.panasonic.com/industrial/components/pdf/AOA0000CE2.pdf
R11 = ERJ8EN: Precision Thick Film Chip Resistor, 10 Ohm to 2.2M Ohm Range, 1% Tolerance, 1206 Size, 0.125 W; Published: 17-Dec-2003; LatestRevisionDate: 19-Mar-2004; LatestRevisionNote: Silkscreen size reduced.; PackageDocument: Mar-2003; PackageReference: 8-1206; Publisher: Altium Limited; Code_IPC: 3216 [1206]; ComponentLink1Description: Manufacturer Link; ComponentLink1URL: http://www.panasonic.com/industrial/components/resistive_products.htm; ComponentLink2Description: Datasheet; ComponentLink2URL: http://www.panasonic.com/industrial/components/pdf/AOA0000CE2.pdf
U13 = LT3652IMSEPBF: Battery Charger Li-Ion 2000mA 4.2V Automotive 12-Pin MSOP EP Tube; MP: LT3652IMSE#PBF; MF: Analog Devices; Package: MSOP W/ EP-12 Analog Devices; Digi-Key_Purchase_URL: https://www.digikey.com/product-detail/en/linear-technology-analog-devices/LT3652IMSE-PBF/LT3652IMSE-PBF-ND/2237473?utm_source=snapeda&utm_medium=aggregator&utm_campaign=symbol; Value: *; Digi-Key_Part_Number: LT3652IMSE#PBF-ND; SnapEDA_Link: https://www.snapeda.com/parts/LT3652IMSE%23PBF/Analog%20Devices/view-part/4331669/?ref=snap
L2 = Inductor2016: Supplier 1: Digi-Key

## Sheet medusa-ai-sensors.SchDoc
size Legal; SheetNumber: 4; SheetTotal: 5
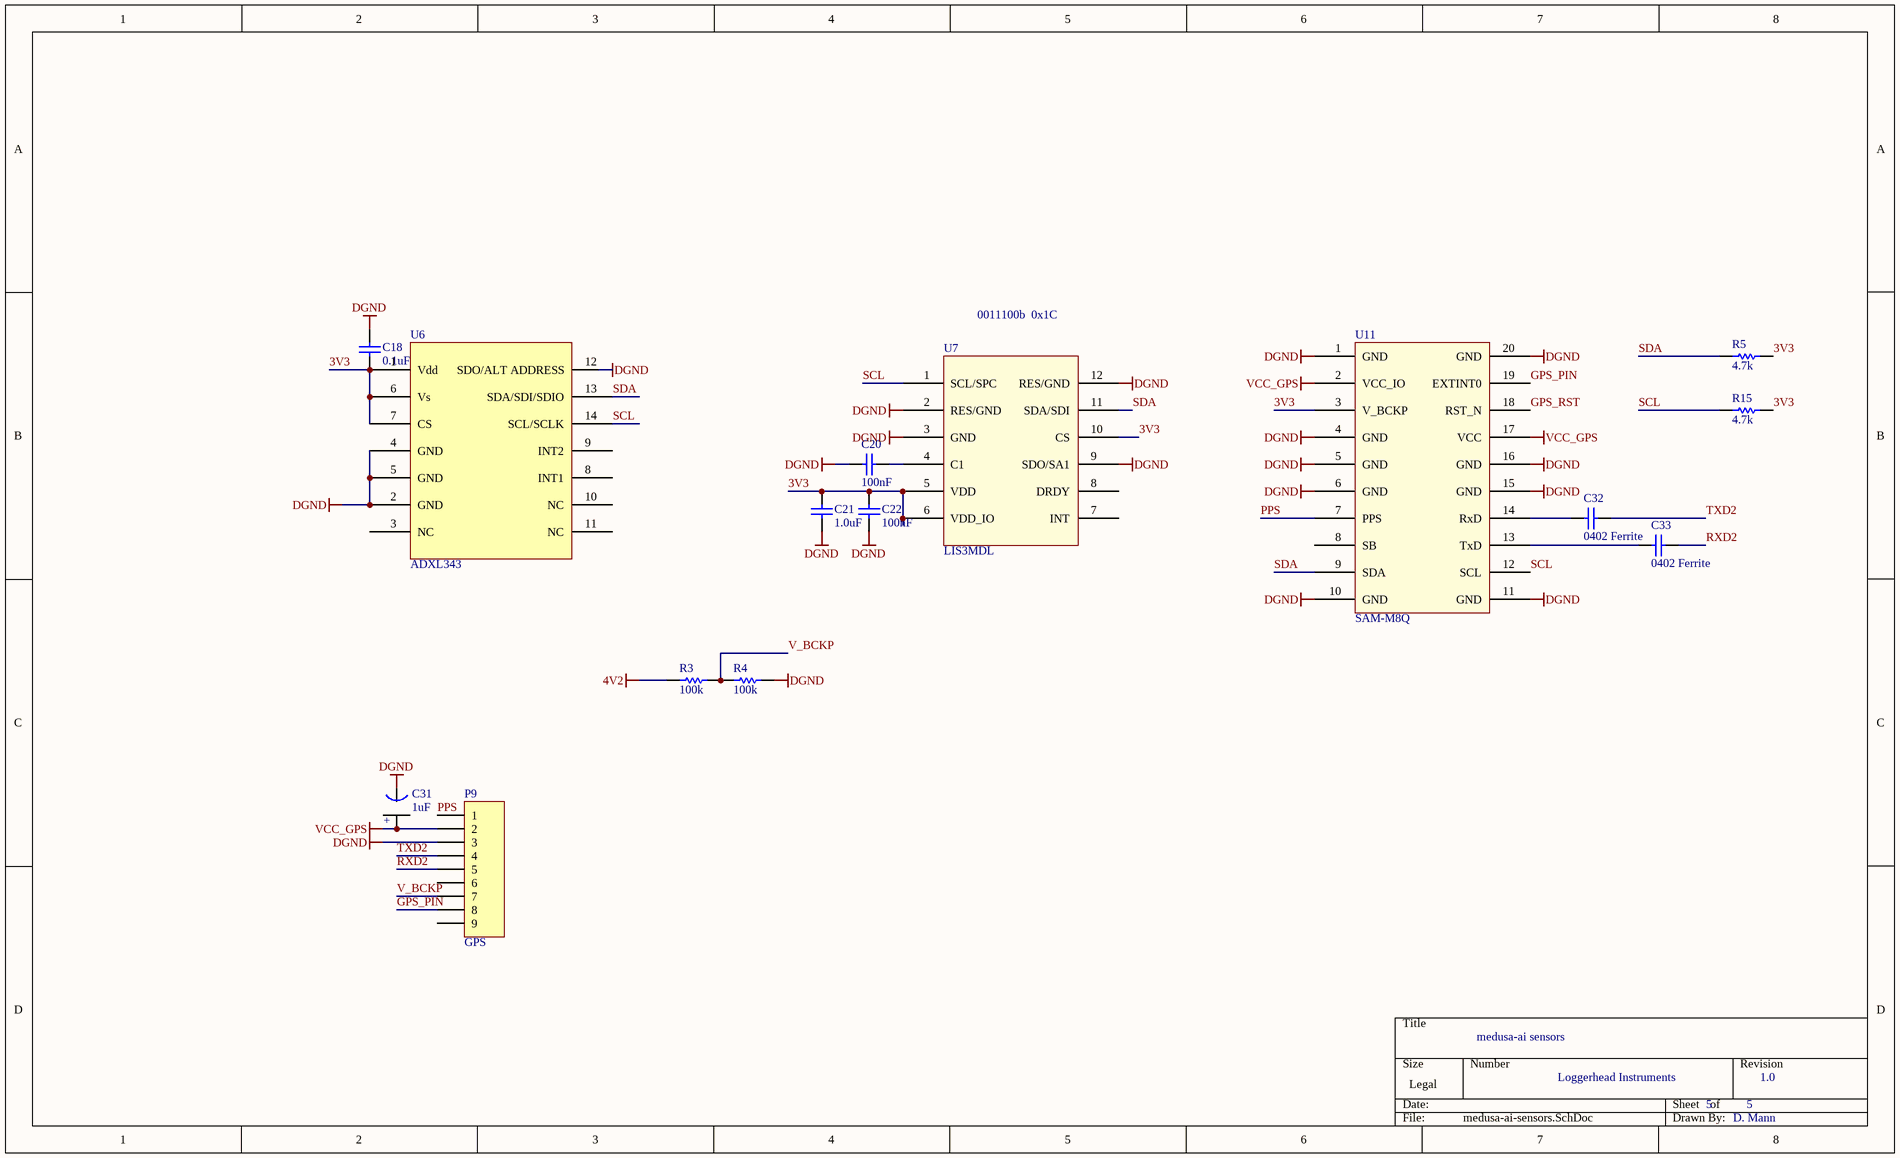
[diagram p3: medusa-ai-sensors.SchDoc]

### Parts
C18  0.1uF  [0402]
C20  100nF  [0402]
C21  1.0uF  [0402]
C22  100nF  [0402]
C31  1uF  [Tant0805]
C32  0402 Ferrite  [0402]
C33  0402 Ferrite  [0402]
P9  GPS  [HDR1X9]
R3  100k  [3-0603]
R4  100k  [3-0603]
R5  4.7k  [3-0603]
R15  4.7k  [3-0603]
U6  ADXL343  [ADXL345]
U7  LIS3MDL  [LGA-12]
U11  SAM-M8Q  [GPS SAM-MQ8]

### Nets
3V3: C18.1 C21.1 C22.1 R5.2 R15.2 U6.1(Vdd) U6.6(Vs) U6.7(CS) U7.5(VDD) U7.6(VDD_IO) U7.10(CS) U11.3(V_BCKP)
4V2: R3.2
DGND: C18.2 C20.1 C21.2 C22.2 C31.1(GND) P9.3 R4.1 U6.2(GND) U6.4(GND) U6.5(GND) U6.12(SDO/ALT_ADDRESS) U7.2(RES/GND) U7.3(GND) U7.9(SDO/SA1) U7.12(RES/GND) U11.1(GND) U11.4(GND) U11.5(GND) U11.6(GND) U11.10(GND) U11.11(GND) U11.15(GND) U11.16(GND) U11.20(GND)
VCC_GPS: C31.2(+) P9.2 U11.2(VCC_IO) U11.17(VCC)
GPS_PIN: P9.8 U11.19(EXTINT0)
GPS_RST: U11.18(RST_N)
PPS: P9.1 U11.7(PPS)
RXD2: C33.2 P9.5
SCL: R15.1 U6.14(SCL/SCLK) U7.1(SCL/SPC) U11.12(SCL)
SDA: R5.1 U6.13(SDA/SDI/SDIO) U7.11(SDA/SDI) U11.9(SDA)
TXD2: C32.2 P9.4
V_BCKP: P9.7 R3.1 R4.2
NetC20_2: C20.2 U7.4(C1)
NetC32_1: C32.1 U11.14(RxD)
NetC33_1: C33.1 U11.13(TxD)

Not connected (* = marked no-connect by the designer): P9 6 9; U6 3(NC) 8(INT1) 9(INT2) 10(NC) 11(NC); U7 7(INT) 8(DRDY); U11 8(SB)

### Notes on the sheet
- 0011100b  0x1C
- medusa-ai sensors
- Loggerhead Instruments
- 5
- 1.0
- D. Mann

### Library data of the parts
C18 C21 = C0402: as C4 on sheet medusa-ai-audio; Published: 17-Jul-2002; LatestRevisionDate: 19-Mar-2004; LatestRevisionNote: Silkscreen size reduced.; DatasheetDocument: Mar-2001; PackageDocument: Mar-2001; PackageReference: 0402; Publisher: Altium Limited; Code_JEITA: 0402; Code_IPC: 1005 [0402]; ComponentLink1Description: Manufacturer Link; ComponentLink1URL: http://www.kemet.com/; ComponentLink2Description: Datasheet; ComponentLink2URL: http://www.kemet.com/kemet/web/homepage/kechome.nsf/vapubfilesname/F3102TA.pdf/$file/F3102TA.pdf
  C18: Value: 0.1uF
  C21: Value: 1.0uF
C20 C22 = C0402: Ceramic Chip Capacitor - Standard; Note: Footprint corresponds to dimensions for bulk cassette packaging. This case size has tightened tolerances.; Value: 1.0uF; Published: 17-Jul-2002; LatestRevisionDate: 19-Mar-2004; LatestRevisionNote: Silkscreen size reduced.; DatasheetDocument: Mar-2001; PackageDocument: Mar-2001; PackageReference: 0402; Publisher: Altium Limited; Code_JEITA: 0402; Code_IPC: 1005 [0402]; ComponentLink1Description: Manufacturer Link; ComponentLink1URL: http://www.kemet.com/; ComponentLink2Description: Datasheet; ComponentLink2URL: http://www.kemet.com/kemet/web/homepage/kechome.nsf/vapubfilesname/F3102TA.pdf/$file/F3102TA.pdf
C31 = Tant0805: Value: 1uF
C32 C33 = C0402: Ceramic Chip Capacitor - Standard; Note: Footprint corresponds to dimensions for bulk cassette packaging. This case size has tightened tolerances.; Value: 100pF; Published: 17-Jul-2002; LatestRevisionDate: 19-Mar-2004; LatestRevisionNote: Silkscreen size reduced.; DatasheetDocument: Mar-2001; PackageDocument: Mar-2001; PackageReference: 0402; Publisher: Altium Limited; Code_JEITA: 0402; Code_IPC: 1005 [0402]; ComponentLink1Description: Manufacturer Link; ComponentLink1URL: http://www.kemet.com/; ComponentLink2Description: Datasheet; ComponentLink2URL: http://www.kemet.com/kemet/web/homepage/kechome.nsf/vapubfilesname/F3102TA.pdf/$file/F3102TA.pdf
P9 = Header 9: Header, 9-Pin; LatestRevisionDate: 17-Jul-2002; LatestRevisionNote: Re-released for DXP Platform.; Publisher: Altium Limited
R3-R5 R15 = ERJ3RK: as R17 on sheet medusa-ai-audio; Published: 17-Dec-2003; LatestRevisionDate: 19-Mar-2004; LatestRevisionNote: Silkscreen size reduced.; PackageDocument: Mar-2003; PackageReference: 3-0603; Publisher: Altium Limited; Code_IPC: 1608 [0603]; ComponentLink1Description: Manufacturer Link; ComponentLink1URL: http://www.panasonic.com/industrial/components/resistive_products.htm; ComponentLink2Description: Datasheet; ComponentLink2URL: http://www.panasonic.com/industrial/components/pdf/AOA0000CE2.pdf
U6 = ADXL345
U7 = LIS3MDL: magnetometer
U11 = GPS SAM-M8Q

## Sheet Medusa-AI-coral-dev.SchDoc
size Legal; SheetNumber: 5; SheetTotal: 5
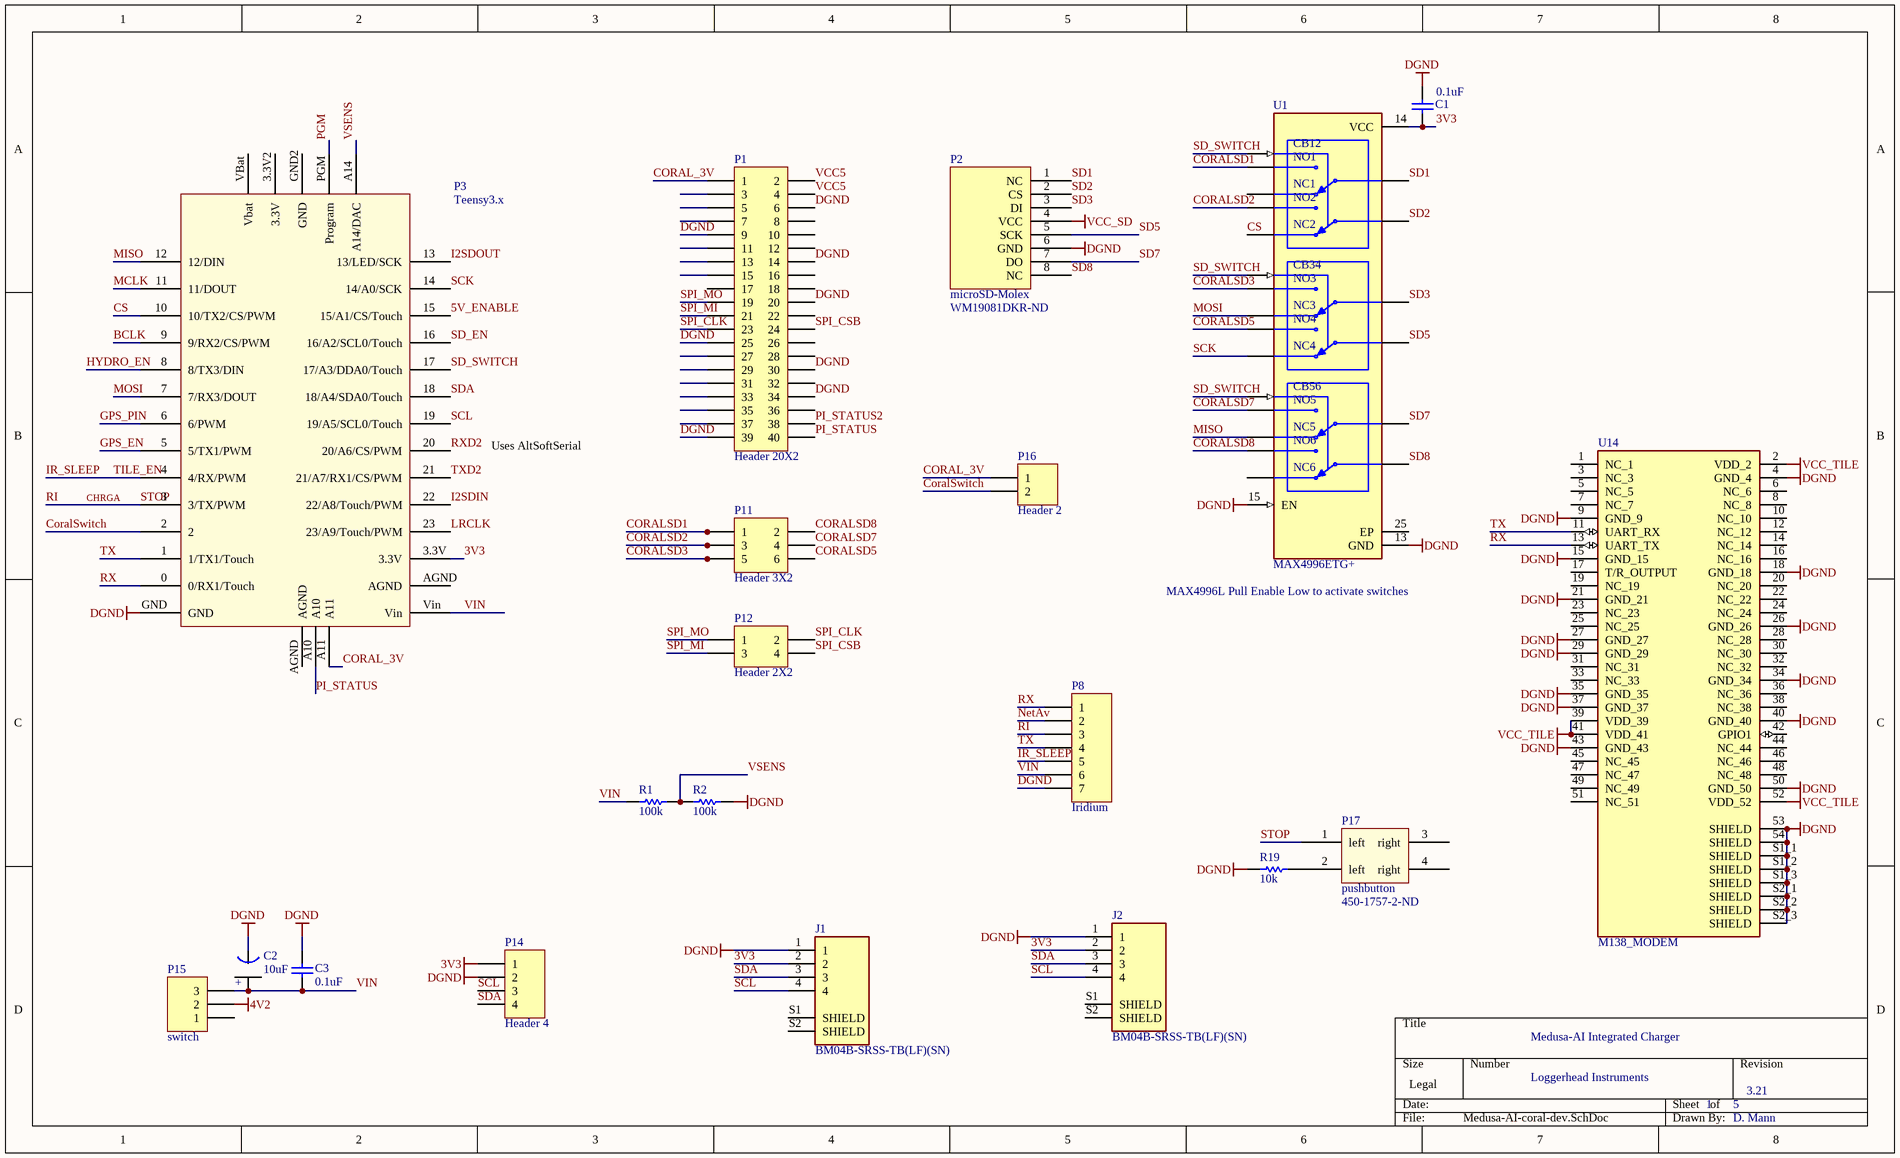
[diagram p4: Medusa-AI-coral-dev.SchDoc]

### Parts
C1  0.1uF  [0402]
C2  10uF  [Tant0805]
C3  0.1uF  [0402]
J1  BM04B-SRSS-TB(LF)(SN)  [CONN_BM04B-SRSS-TB(LF)(SN)]
J2  BM04B-SRSS-TB(LF)(SN)  [CONN_BM04B-SRSS-TB(LF)(SN)]
P1  Header 20X2  [HDR2X20]
P2  microSD-Molex  Supplier Part Number 1: WM19081DKR-ND  [microSD_Molex_hinged]
P3  Teensy3.x  [Teensy3.x]
P8  Iridium  [HDR1X7]
P11  Header 3X2  [HDR2X3]
P12  Header 2X2  [HDR2X2]
P14  Header 4  [HDR1X4]
P15  switch  [HDR1X3]
P16  Header 2  [HDR1X2]
P17  pushbutton  Supplier Part Number 1: 450-1757-2-ND  [SOP4]
R1  100k  [3-0603]
R2  100k  [3-0603]
R19  10k  [3-0603]
U1  MAX4996ETG+  [QFN40P350X350X80-25N]
U14  M138_MODEM  [XCVR_M138_MODEM]

### Nets
3V3: C1.1 J1.2 J2.2 P3.3.3V P14.1 U1.14(VCC)
4V2: P15.2
DGND: C1.2 C2.1(GND) C3.2 J1.1 J2.1 P1.6 P1.9 P1.14 P1.20 P1.25 P1.30 P1.34 P1.39 P2.6(GND) P3.GND P8.7 P14.2 R2.1 R19.2 U1.13(GND) U1.15(EN) U14.4(GND_4) U14.9(GND_9) U14.15(GND_15) U14.18(GND_18) U14.21(GND_21) U14.26(GND_26) U14.27(GND_27) U14.29(GND_29) U14.34(GND_34) U14.35(GND_35) U14.37(GND_37) U14.40(GND_40) U14.43(GND_43) U14.50(GND_50) U14.53(SHIELD) U14.54(SHIELD) U14.S1_1(SHIELD) U14.S1_2(SHIELD) U14.S1_3(SHIELD) U14.S2_1(SHIELD) U14.S2_2(SHIELD) U14.S2_3(SHIELD)
VCC_SD: P2.4(VCC)
VCC_TILE: U14.2(VDD_2) U14.39(VDD_39) U14.41(VDD_41) U14.52(VDD_52)
VIN: C2.2(+) C3.1 P3.Vin P8.6 P15.3 R1.2
5V_ENABLE: P3.15(15/A1/CS/Touch)
BCLK: P3.9(9/RX2/CS/PWM)
CHRGA: P3.3(3/TX/PWM) P8.3 P17.1(left)  [also labelled RI, STOP]
CORAL_3V: P1.1 P3.A11 P16.1
CORALSD1: P11.1 U1.19(NO1)
CORALSD2: P11.3 U1.20(NO2)
CORALSD3: P11.5 U1.21(NO3)
CORALSD5: P11.6 U1.22(NO4)
CORALSD7: P11.4 U1.23(NO5)
CORALSD8: P11.2 U1.24(NO6)
CoralSwitch: P3.2 P16.2
CS: P3.10(10/TX2/CS/PWM) U1.11(NC2)
GPS_EN: P3.5(5/TX1/PWM)
GPS_PIN: P3.6(6/PWM)
HYDRO_EN: P3.8(8/TX3/DIN)
I2SDIN: P3.22(22/A8/Touch/PWM)
I2SDOUT: P3.13(13/LED/SCK)
IR_SLEEP: P3.4(4/RX/PWM) P8.5  [also labelled TILE_EN]
LRCLK: P3.23(23/A9/Touch/PWM)
MCLK: P3.11(11/DOUT)
MISO: P3.12(12/DIN) U1.8(NC5)
MOSI: P3.7(7/RX3/DOUT) U1.10(NC3)
NetAv: P8.2
PGM: P3.PGM(Program)
PI_STATUS: P1.40 P3.A10
PI_STATUS2: P1.38
RX: P3.0(0/RX1/Touch) P8.1 U14.13(UART_TX)
RXD2: P3.20(20/A6/CS/PWM)
SCK: P3.14(14/A0/SCK) U1.9(NC4)
SCL: J1.4 J2.4 P3.19(19/A5/SCL0/Touch) P14.3
SD1: P2.1(NC) U1.18(COM1)
SD2: P2.2(CS) U1.17(COM2)
SD3: P2.3(DI) U1.16(COM3)
SD5: P2.5(SCK) U1.4(COM4)
SD7: P2.7(DO) U1.5(COM5)
SD8: P2.8(NC) U1.6(COM6)
SD_EN: P3.16(16/A2/SCL0/Touch)
SD_SWITCH: P3.17(17/A3/DDA0/Touch) U1.1(CB12) U1.2(CB34) U1.3(CB56)
SDA: J1.3 J2.3 P3.18(18/A4/SDA0/Touch) P14.4
SPI_CLK: P1.23 P12.2
SPI_CSB: P1.24 P12.4
SPI_MI: P1.21 P12.3
SPI_MO: P1.19 P12.1
TX: P3.1(1/TX1/Touch) P8.4 U14.11(UART_RX)
TXD2: P3.21(21/A7/RX1/CS/PWM)
VCC5: P1.2 P1.4
VSENS: P3.A14(A14/DAC) R1.1 R2.2
NetP17_2: P17.2(left) R19.1

Not connected (* = marked no-connect by the designer): J1 S1(SHIELD) S2(SHIELD); J2 S1(SHIELD) S2(SHIELD); P1 3 5 7 8 10 11 12 13 15 16 17 18 22 26 27 28 29 31 32 33 35 36 37; P3 3.3V2(3.3V) AGND GND2(GND) VBat(Vbat); P15 1; P17 3(right) 4(right); U1 7(NC6) 12(NC1) 25(EP); U14 1(NC_1) 3(NC_3) 5(NC_5) 6(NC_6) 7(NC_7) 8(NC_8) 10(NC_10) 12(NC_12) 14(NC_14) 16(NC_16) 17(T/R_OUTPUT) 19(NC_19) 20(NC_20) 22(NC_22) 23(NC_23) 24(NC_24) 25(NC_25) 28(NC_28) 30(NC_30) 31(NC_31) 32(NC_32) 33(NC_33) 36(NC_36) 38(NC_38) 42(GPIO1) 44(NC_44) 45(NC_45) 46(NC_46) 47(NC_47) 48(NC_48) 49(NC_49) 51(NC_51)

### Notes on the sheet
- Uses AltSoftSerial
- (near U1) MAX4996L Pull Enable Low to activate switches
- Medusa-AI Integrated Charger
- Loggerhead Instruments
- 1
- 5
- 3.21
- D. Mann

### Library data of the parts
C1 C3 = C0402: as C4 on sheet medusa-ai-audio; Published: 17-Jul-2002; LatestRevisionDate: 19-Mar-2004; LatestRevisionNote: Silkscreen size reduced.; DatasheetDocument: Mar-2001; PackageDocument: Mar-2001; PackageReference: 0402; Publisher: Altium Limited; Code_JEITA: 0402; Code_IPC: 1005 [0402]; ComponentLink1Description: Manufacturer Link; ComponentLink1URL: http://www.kemet.com/; ComponentLink2Description: Datasheet; ComponentLink2URL: http://www.kemet.com/kemet/web/homepage/kechome.nsf/vapubfilesname/F3102TA.pdf/$file/F3102TA.pdf; Value: 0.1uF
C2 = Tant0805: Value: 10uF
J1 J2 = BM04B-SRSS-TB(LF)(SN): Connector Header Surface Mount 4 position 0.039 _1.00mm_; MF: JST Sales; MP: BM04B-SRSS-TB_LF__SN_; Price: None; Availability: Unavailable; Package: None; SnapEDA_Link: https://www.snapeda.com/parts/BM04B-SRSS-TB%28LF%29%28SN%29/JST%20Sales%20America%20Inc./view-part/91778/?ref=snap; Value: *
P1 = Header 20X2: Header, 20-Pin, Dual row; LatestRevisionDate: 17-Jul-2002; LatestRevisionNote: Re-released for DXP Platform.; Publisher: Altium Limited
P2 = microSD_Molex_hinged: Supplier 1: Digi-Key
P8 = Header 7: Header, 7-Pin; LatestRevisionDate: 17-Jul-2002; LatestRevisionNote: Re-released for DXP Platform.; Publisher: Altium Limited
P11 = Header 3X2: Header, 3-Pin, Dual row; LatestRevisionDate: 17-Jul-2002; LatestRevisionNote: Re-released for DXP Platform.; Publisher: Altium Limited
P12 = Header 2X2: Header, 2-Pin, Dual row; LatestRevisionDate: 17-Jul-2002; LatestRevisionNote: Re-released for DXP Platform.; Publisher: Altium Limited
P14 = Header 4: Header, 4-Pin; LatestRevisionDate: 17-Jul-2002; LatestRevisionNote: Re-released for DXP Platform.; Publisher: Altium Limited
P15 = Header 3: Header, 3-Pin; LatestRevisionDate: 17-Jul-2002; LatestRevisionNote: Re-released for DXP Platform.; Publisher: Altium Limited
P16 = Header 2: Header, 2-Pin; LatestRevisionDate: 17-Jul-2002; LatestRevisionNote: Re-released for DXP Platform.; Publisher: Altium Limited
R1 R2 R19 = ERJ3RK: as R17 on sheet medusa-ai-audio; Published: 17-Dec-2003; LatestRevisionDate: 19-Mar-2004; LatestRevisionNote: Silkscreen size reduced.; PackageDocument: Mar-2003; PackageReference: 3-0603; Publisher: Altium Limited; Code_IPC: 1608 [0603]; ComponentLink1Description: Manufacturer Link; ComponentLink1URL: http://www.panasonic.com/industrial/components/resistive_products.htm; ComponentLink2Description: Datasheet; ComponentLink2URL: http://www.panasonic.com/industrial/components/pdf/AOA0000CE2.pdf
U1 = MAX4996ETG+: 3 Circuit IC Switch 2:2 4Ohm 24-TQFN (4x4); MF: Maxim Integrated; SnapEDA_Link: https://www.snapeda.com/parts/MAX4996ETG+/Maxim%20Integrated/view-part/1193961/?ref=snap; Value: *; Purchase-URL: https://pricing.snapeda.com/search/part/MAX4996ETG+/?ref=eda; Price: None; Availability: Warning; Check_prices: https://www.snapeda.com/parts/MAX4996ETG+/Maxim%20Integrated/view-part/1193961/?ref=eda; MP: MAX4996ETG+; Package: TQFN-24 Maxim
U14 = M138_MODEM: Swarm M138 Modem; MF: Swarm; Check_prices: https://www.snapeda.com/parts/M138%20Modem/Swarm/view-part/?ref=eda; Value: *; Package: Package; Price: None; Availability: Not in stock; MP: M138 Modem; SnapEDA_Link: https://www.snapeda.com/parts/M138%20Modem/Swarm/view-part/?ref=snap
P17 = pushbutton: Supplier 1: Digi-Key

## Nets that join several sheets
3V3: medusa-charger (P13.1 R6.1 R8.1), medusa-ai-sensors (12 pins), Medusa-AI-coral-dev (6 pins)
4V2: medusa-charger (6 pins), medusa-ai-sensors (R3.2), Medusa-AI-coral-dev (P15.2)
DGND: medusa-ai-audio (P4.2 R18.1), medusa-ai-power (26 pins), medusa-charger (28 pins), medusa-ai-sensors (24 pins), Medusa-AI-coral-dev (43 pins)
VCC_GPS: medusa-ai-power (C26.1 U9.5), medusa-ai-sensors (C31.2 P9.2 U11.2 U11.17)
VCC_SD: medusa-ai-power (C28.1 U10.5), Medusa-AI-coral-dev (P2.4)
VCC_TILE: medusa-ai-power (5 pins), Medusa-AI-coral-dev (U14.2 U14.39 U14.41 U14.52)
VIN: medusa-ai-audio (8 pins), medusa-ai-power (10 pins), Medusa-AI-coral-dev (6 pins)
5V_ENABLE: medusa-ai-power (U12.9), Medusa-AI-coral-dev (P3.15)
BCLK: medusa-ai-audio (U3.24), Medusa-AI-coral-dev (P3.9)
CHRGA: medusa-charger (P13.6), Medusa-AI-coral-dev (P3.3 P8.3 P17.1)
GPS_EN: medusa-ai-power (U9.3), Medusa-AI-coral-dev (P3.5)
GPS_PIN: medusa-ai-sensors (P9.8 U11.19), Medusa-AI-coral-dev (P3.6)
HYDRO_EN: medusa-ai-audio (U2.3 U4.3 U5.3 U8.3), Medusa-AI-coral-dev (P3.8)
I2SDIN: medusa-ai-audio (U3.26), Medusa-AI-coral-dev (P3.22)
I2SDOUT: medusa-ai-audio (U3.25), Medusa-AI-coral-dev (P3.13)
IR_SLEEP: medusa-ai-power (R16.1 U15.5), Medusa-AI-coral-dev (P3.4 P8.5)
LRCLK: medusa-ai-audio (U3.23), Medusa-AI-coral-dev (P3.23)
MCLK: medusa-ai-audio (U3.21), Medusa-AI-coral-dev (P3.11)
PPS: medusa-ai-audio (R17.2), medusa-ai-sensors (P9.1 U11.7)
RXD2: medusa-ai-sensors (C33.2 P9.5), Medusa-AI-coral-dev (P3.20)
SCL: medusa-ai-audio (U3.29), medusa-ai-sensors (R15.1 U6.14 U7.1 U11.12), Medusa-AI-coral-dev (J1.4 J2.4 P3.19 P14.3)
SD_EN: medusa-ai-power (U10.3), Medusa-AI-coral-dev (P3.16)
SDA: medusa-ai-audio (U3.27), medusa-ai-sensors (R5.1 U6.13 U7.11 U11.9), Medusa-AI-coral-dev (J1.3 J2.3 P3.18 P14.4)
TXD2: medusa-ai-sensors (C32.2 P9.4), Medusa-AI-coral-dev (P3.21)
VCC5: medusa-ai-power (6 pins), Medusa-AI-coral-dev (P1.2 P1.4)